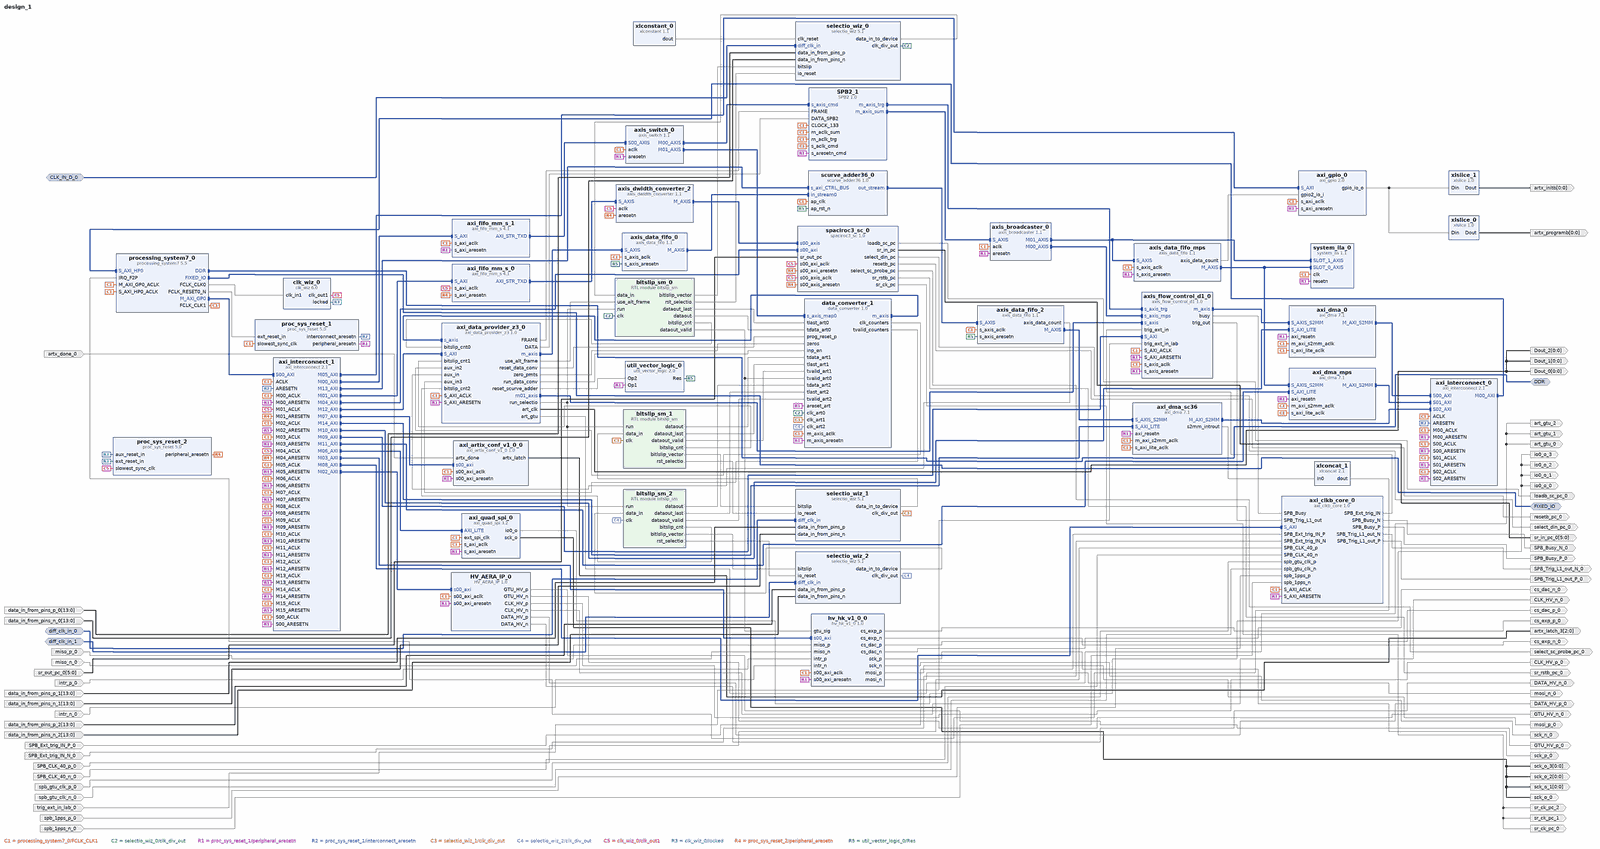
[diagram p0: block diagram of the top level, whole]
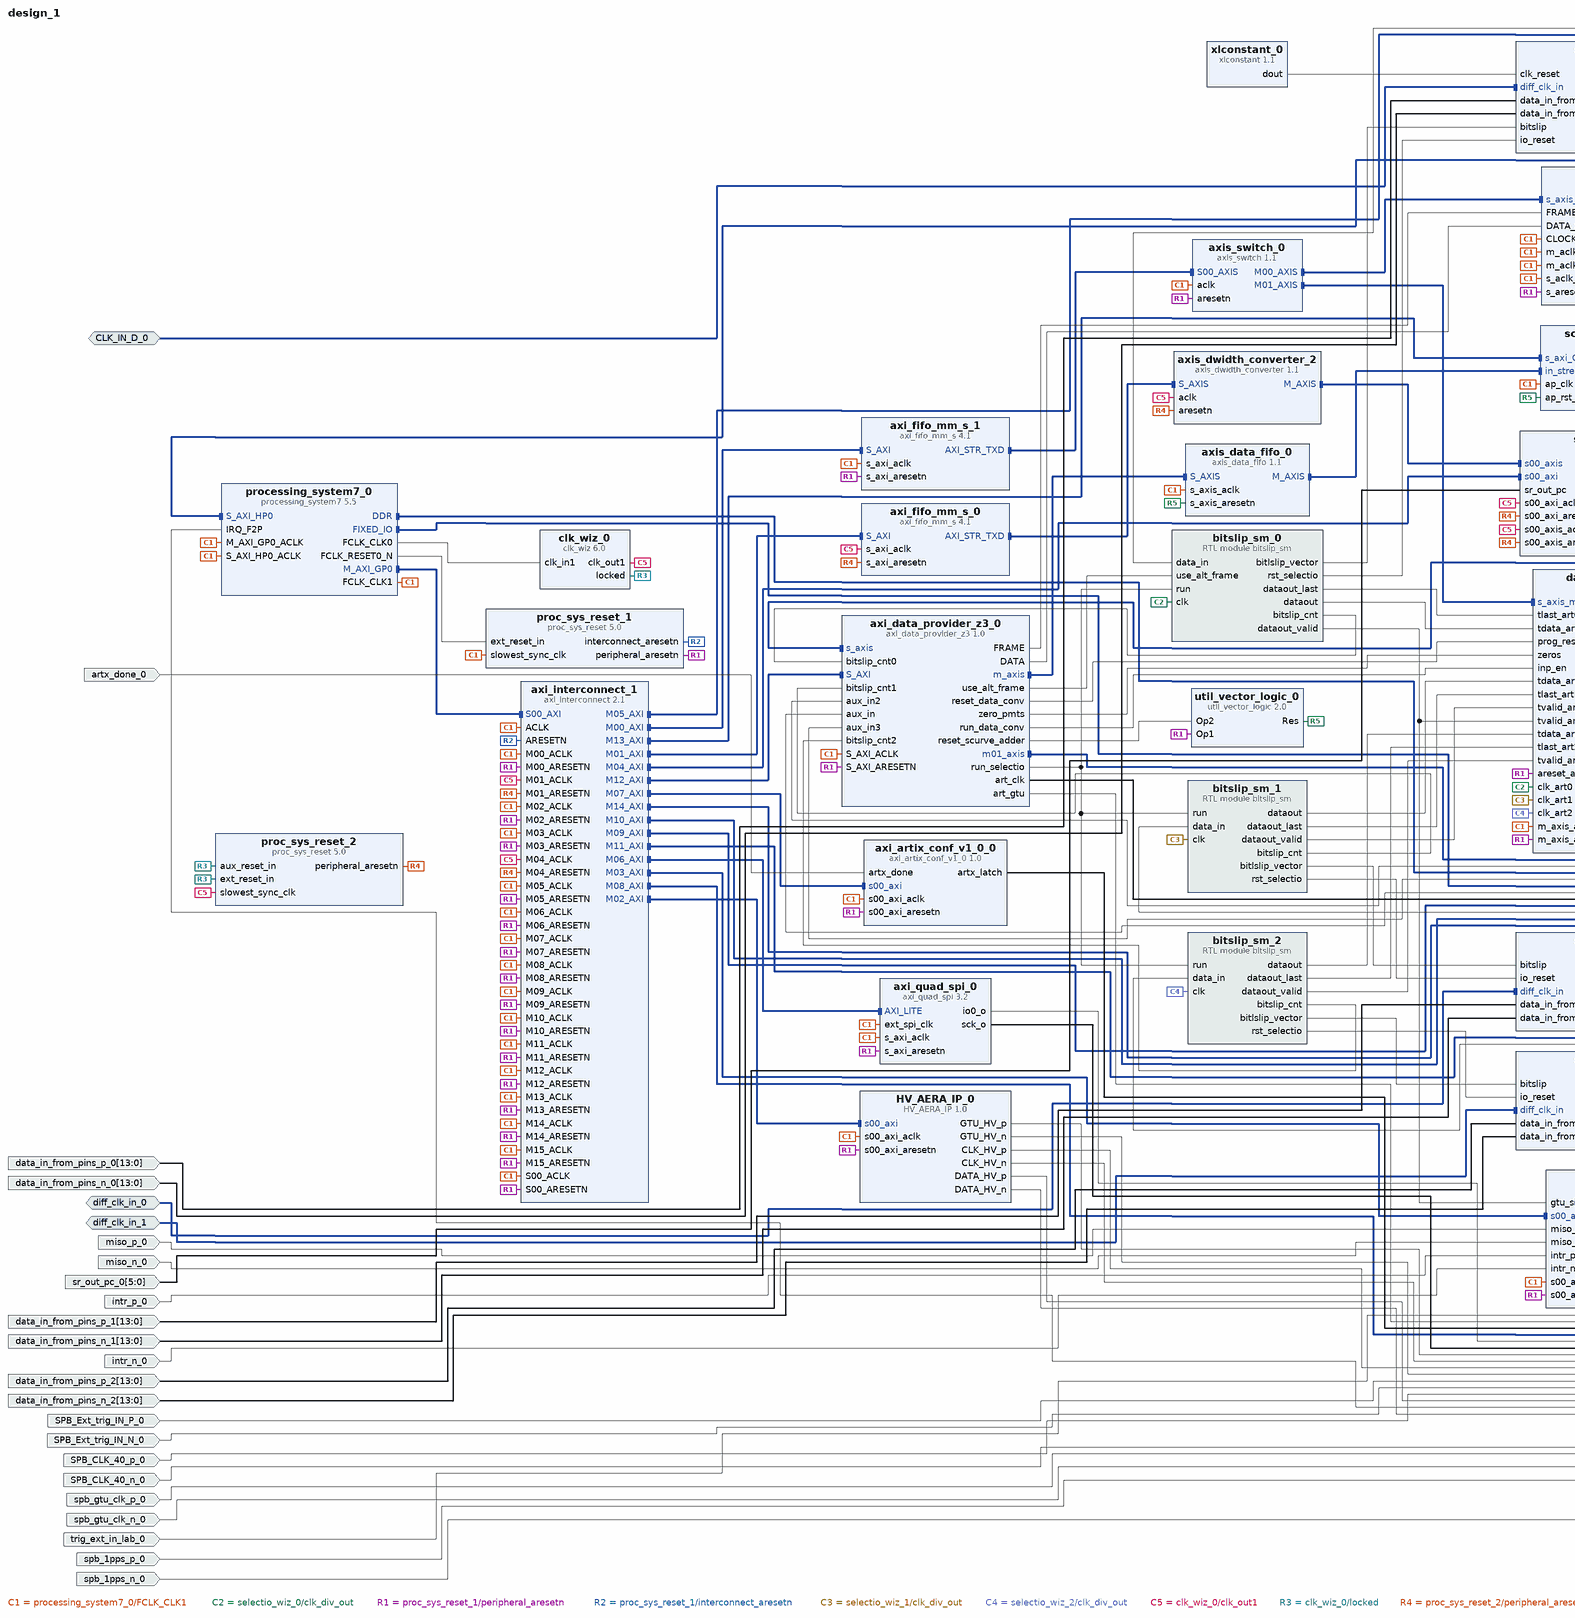
[diagram p1: block diagram of the top level, left part]
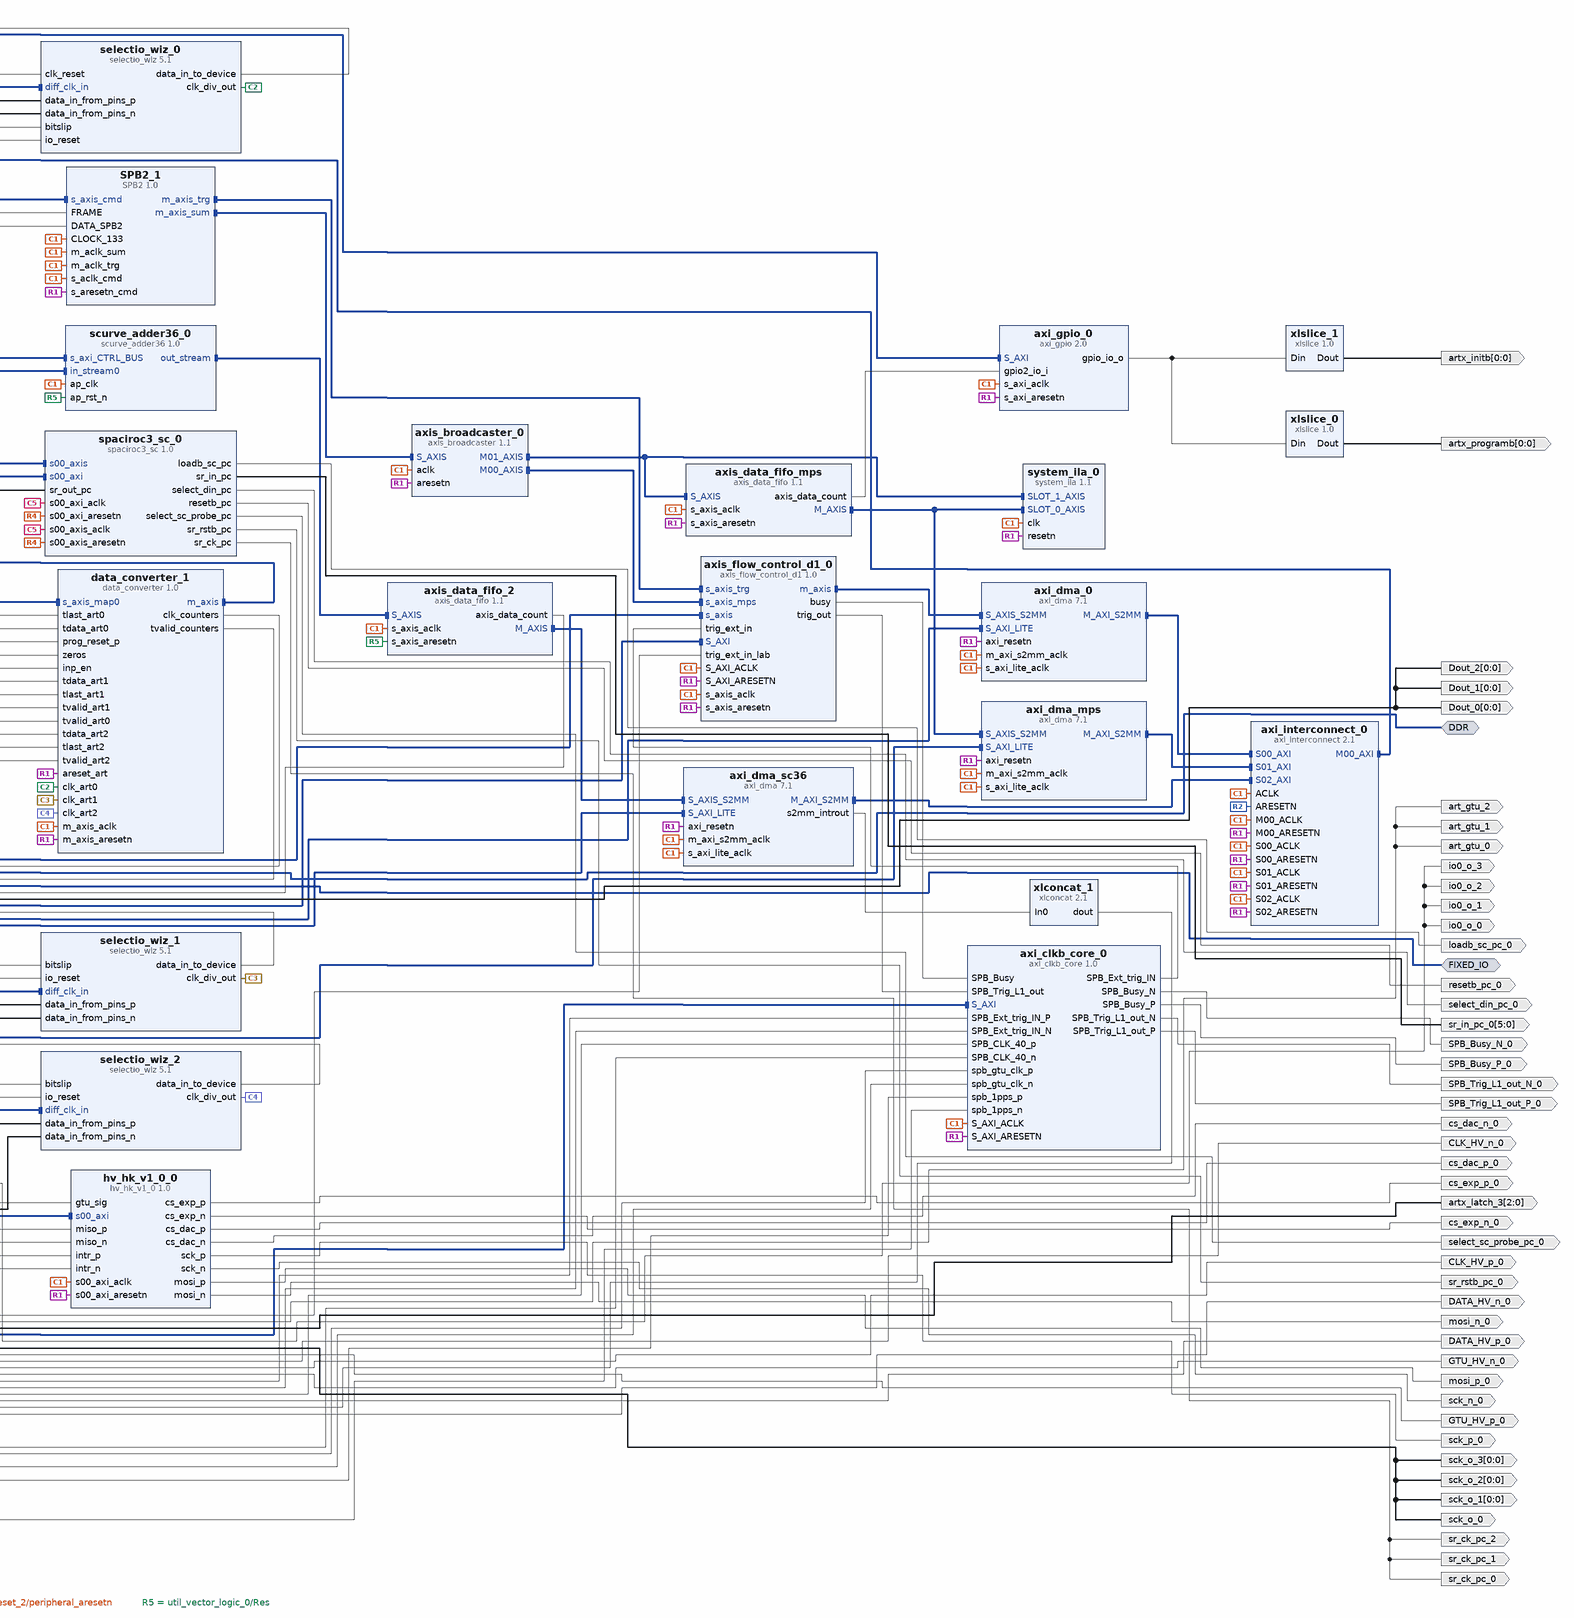
[diagram p2: block diagram of the top level, right part]
# Vivado block design design_1, xc7z035ffg676-2, Vivado 2018.1
create_bd_design design_1

create_bd_intf_port -mode Master -vlnv xilinx.com:interface:ddrx_rtl:1.0 DDR
create_bd_intf_port -mode Master -vlnv xilinx.com:display_processing_system7:fixedio_rtl:1.0 FIXED_IO
create_bd_intf_port -mode Slave -vlnv xilinx.com:interface:diff_clock_rtl:1.0 CLK_IN_D_0
create_bd_intf_port -mode Slave -vlnv xilinx.com:interface:diff_clock_rtl:1.0 diff_clk_in_0
create_bd_intf_port -mode Slave -vlnv xilinx.com:interface:diff_clock_rtl:1.0 diff_clk_in_1
create_bd_port -dir O -from 0 -to 0 Dout_2
create_bd_port -dir O -from 0 -to 0 Dout_1
create_bd_port -dir O -from 0 -to 0 Dout_0
create_bd_port -dir I -from 13 -to 0 data_in_from_pins_p_0
create_bd_port -dir I -from 13 -to 0 data_in_from_pins_n_0
create_bd_port -dir O sck_p_0
create_bd_port -dir O sck_n_0
create_bd_port -dir O mosi_p_0
create_bd_port -dir O mosi_n_0
create_bd_port -dir O cs_exp_p_0
create_bd_port -dir O cs_exp_n_0
create_bd_port -dir O cs_dac_p_0
create_bd_port -dir O cs_dac_n_0
create_bd_port -dir I miso_p_0
create_bd_port -dir I miso_n_0
create_bd_port -dir I intr_p_0
create_bd_port -dir I intr_n_0
create_bd_port -dir O -from 5 -to 0 sr_in_pc_0
create_bd_port -dir O loadb_sc_pc_0
create_bd_port -dir O select_din_pc_0
create_bd_port -dir O resetb_pc_0
create_bd_port -dir O select_sc_probe_pc_0
create_bd_port -dir O sr_rstb_pc_0
create_bd_port -dir O sr_ck_pc_1
create_bd_port -dir O sr_ck_pc_2
create_bd_port -dir O sr_ck_pc_0
create_bd_port -dir O GTU_HV_p_0
create_bd_port -dir O GTU_HV_n_0
create_bd_port -dir O CLK_HV_p_0
create_bd_port -dir O CLK_HV_n_0
create_bd_port -dir O DATA_HV_p_0
create_bd_port -dir O DATA_HV_n_0
create_bd_port -dir O io0_o_0
create_bd_port -dir O io0_o_1
create_bd_port -dir O io0_o_2
create_bd_port -dir O io0_o_3
create_bd_port -dir O sck_o_0
create_bd_port -dir O -from 0 -to 0 sck_o_1
create_bd_port -dir O -from 0 -to 0 sck_o_2
create_bd_port -dir O -from 0 -to 0 sck_o_3
create_bd_port -dir I artx_done_0
create_bd_port -dir I -from 13 -to 0 data_in_from_pins_p_1
create_bd_port -dir I -from 13 -to 0 data_in_from_pins_n_1
create_bd_port -dir I -from 13 -to 0 data_in_from_pins_p_2
create_bd_port -dir I -from 13 -to 0 data_in_from_pins_n_2
create_bd_port -dir O -from 0 -to 0 artx_programb
create_bd_port -dir O -from 0 -to 0 artx_initb
create_bd_port -dir I -from 5 -to 0 sr_out_pc_0
create_bd_port -dir O art_gtu_0
create_bd_port -dir O art_gtu_1
create_bd_port -dir O art_gtu_2
create_bd_port -dir O -from 2 -to 0 artx_latch_3
create_bd_port -dir I SPB_Ext_trig_IN_P_0
create_bd_port -dir I SPB_Ext_trig_IN_N_0
create_bd_port -dir I SPB_CLK_40_p_0
create_bd_port -dir I SPB_CLK_40_n_0
create_bd_port -dir O SPB_Trig_L1_out_P_0
create_bd_port -dir O SPB_Trig_L1_out_N_0
create_bd_port -dir O SPB_Busy_P_0
create_bd_port -dir O SPB_Busy_N_0
create_bd_port -dir I -type clk spb_gtu_clk_p_0
create_bd_port -dir I -type clk spb_gtu_clk_n_0
create_bd_port -dir I spb_1pps_p_0
create_bd_port -dir I spb_1pps_n_0
create_bd_port -dir I trig_ext_in_lab_0

create_bd_cell -type ip -vlnv xilinx.com:ip:processing_system7:5.5 processing_system7_0
set_property -dict [list \
  CONFIG.PCW_FCLK_CLK1_BUF TRUE \
  CONFIG.PCW_FCLK_CLK2_BUF TRUE \
  CONFIG.PCW_UIPARAM_DDR_FREQ_MHZ 533.333333 \
  CONFIG.PCW_CPU_CPU_6X4X_MAX_RANGE 800 \
  CONFIG.PCW_APU_PERIPHERAL_FREQMHZ 800 \
  CONFIG.PCW_SDIO_PERIPHERAL_FREQMHZ 100 \
  CONFIG.PCW_UART_PERIPHERAL_FREQMHZ 100 \
  CONFIG.PCW_FPGA0_PERIPHERAL_FREQMHZ 200 \
  CONFIG.PCW_FPGA1_PERIPHERAL_FREQMHZ 200 \
  CONFIG.PCW_FPGA2_PERIPHERAL_FREQMHZ 200 \
  CONFIG.PCW_FPGA3_PERIPHERAL_FREQMHZ 100 \
  CONFIG.PCW_USE_S_AXI_HP0 1 \
  CONFIG.PCW_USE_FABRIC_INTERRUPT 1 \
  CONFIG.PCW_EN_CLK1_PORT 1 \
  CONFIG.PCW_EN_CLK2_PORT 1 \
  CONFIG.PCW_IRQ_F2P_INTR 1 \
  CONFIG.PCW_GP0_EN_MODIFIABLE_TXN 0 \
  CONFIG.PCW_GP1_EN_MODIFIABLE_TXN 0 \
  CONFIG.PCW_PERIPHERAL_BOARD_PRESET None \
  CONFIG.PCW_PRESET_BANK0_VOLTAGE {LVCMOS 1.8V} \
  CONFIG.PCW_PRESET_BANK1_VOLTAGE {LVCMOS 1.8V} \
  CONFIG.PCW_UIPARAM_DDR_PARTNO {MT41K256M16 RE-15E} \
  CONFIG.PCW_QSPI_PERIPHERAL_ENABLE 0 \
  CONFIG.PCW_ENET0_PERIPHERAL_ENABLE 1 \
  CONFIG.PCW_ENET0_ENET0_IO {MIO 16 .. 27} \
  CONFIG.PCW_ENET0_GRP_MDIO_ENABLE 1 \
  CONFIG.PCW_ENET0_GRP_MDIO_IO {MIO 52 .. 53} \
  CONFIG.PCW_SD0_PERIPHERAL_ENABLE 1 \
  CONFIG.PCW_SD0_SD0_IO {MIO 40 .. 45} \
  CONFIG.PCW_SD0_GRP_CD_ENABLE 0 \
  CONFIG.PCW_SD0_GRP_WP_ENABLE 0 \
  CONFIG.PCW_UART0_PERIPHERAL_ENABLE 1 \
  CONFIG.PCW_UART0_UART0_IO {MIO 50 .. 51} \
  CONFIG.PCW_UART1_PERIPHERAL_ENABLE 0 \
  CONFIG.PCW_USB0_PERIPHERAL_ENABLE 0 \
  CONFIG.PCW_GPIO_MIO_GPIO_ENABLE 0 \
  CONFIG.PCW_FPGA_FCLK1_ENABLE 1 \
  CONFIG.PCW_FPGA_FCLK2_ENABLE 1 \
] [get_bd_cells processing_system7_0]
# 407 more settings of processing_system7_0 are not shown: defaults, MIO pin electricals, DDR timing, and values the tool derives
create_bd_cell -type ip -vlnv xilinx.com:ip:proc_sys_reset:5.0 proc_sys_reset_1
create_bd_cell -type ip -vlnv xilinx.com:ip:axi_interconnect:2.1 axi_interconnect_0
set_property -dict [list \
  CONFIG.NUM_SI 3 \
  CONFIG.NUM_MI 1 \
  CONFIG.M00_HAS_REGSLICE 4 \
  CONFIG.S00_HAS_REGSLICE 4 \
  CONFIG.S01_HAS_REGSLICE 4 \
  CONFIG.S02_HAS_REGSLICE 4 \
] [get_bd_cells axi_interconnect_0]
create_bd_cell -type ip -vlnv xilinx.com:ip:axi_interconnect:2.1 axi_interconnect_1
set_property -dict {CONFIG.NUM_MI 16} [get_bd_cells axi_interconnect_1]
create_bd_cell -type ip -vlnv xilinx.com:ip:selectio_wiz:5.1 selectio_wiz_0
set_property -dict [list \
  CONFIG.BUS_SIG_TYPE DIFF \
  CONFIG.BUS_IO_STD LVDS \
  CONFIG.SELIO_ACTIVE_EDGE DDR \
  CONFIG.USE_SERIALIZATION true \
  CONFIG.SERIALIZATION_FACTOR 8 \
  CONFIG.SYSTEM_DATA_WIDTH 14 \
  CONFIG.SELIO_INTERFACE_TYPE NETWORKING \
  CONFIG.SELIO_BUS_IN_DELAY NONE \
  CONFIG.SELIO_BUS_IN_TAP 3 \
  CONFIG.SELIO_CLK_SIG_TYPE DIFF \
  CONFIG.SELIO_CLK_IO_STD LVDS \
  CONFIG.CLK_DELAY NONE \
  CONFIG.CLK_TAP 8 \
  CONFIG.CLK_FWD_SIG_TYPE DIFF \
  CONFIG.CLK_FWD_IO_STD LVDS \
  CONFIG.INCLUDE_IDELAYCTRL false \
  CONFIG.INCLUDE_IDELAYCTRL_BUFG false \
] [get_bd_cells selectio_wiz_0]
create_bd_cell -type ip -vlnv user.org:user:HV_AERA_IP:1.0 HV_AERA_IP_0
create_bd_cell -type ip -vlnv user.org:user:hv_hk_v1_0:1.0 hv_hk_v1_0_0
create_bd_cell -type ip -vlnv xilinx.com:ip:axis_dwidth_converter:1.1 axis_dwidth_converter_2
set_property -dict {CONFIG.S_TDATA_NUM_BYTES 4 CONFIG.M_TDATA_NUM_BYTES 24} [get_bd_cells axis_dwidth_converter_2]
create_bd_cell -type ip -vlnv xilinx.com:ip:axi_fifo_mm_s:4.1 axi_fifo_mm_s_0
set_property -dict [list \
  CONFIG.C_USE_TX_CUT_THROUGH 0 \
  CONFIG.C_TX_FIFO_PE_THRESHOLD 2 \
  CONFIG.C_TX_FIFO_PF_THRESHOLD 4091 \
  CONFIG.C_TX_FIFO_DEPTH 4096 \
  CONFIG.C_USE_TX_DATA 1 \
  CONFIG.C_USE_RX_DATA 1 \
  CONFIG.C_USE_TX_CTRL 0 \
] [get_bd_cells axi_fifo_mm_s_0]
create_bd_cell -type ip -vlnv xilinx.com:ip:xlconcat:2.1 xlconcat_1
set_property -dict {CONFIG.NUM_PORTS 1} [get_bd_cells xlconcat_1]
create_bd_cell -type ip -vlnv xilinx.com:ip:axi_gpio:2.0 axi_gpio_0
set_property -dict {CONFIG.C_IS_DUAL 1 CONFIG.C_ALL_INPUTS_2 1 CONFIG.C_ALL_OUTPUTS 1} [get_bd_cells axi_gpio_0]
create_bd_cell -type ip -vlnv xilinx.com:ip:axi_quad_spi:3.2 axi_quad_spi_0
set_property -dict [list \
  CONFIG.C_USE_STARTUP 0 \
  CONFIG.C_SCK_RATIO 16 \
  CONFIG.C_FIFO_DEPTH 16 \
  CONFIG.Multiples16 2 \
] [get_bd_cells axi_quad_spi_0]
create_bd_cell -type ip -vlnv xilinx.com:ip:xlconstant:1.1 xlconstant_0
set_property -dict {CONFIG.CONST_VAL 0} [get_bd_cells xlconstant_0]
create_bd_cell -type ip -vlnv xilinx.com:ip:selectio_wiz:5.1 selectio_wiz_2
set_property -dict [list \
  CONFIG.BUS_SIG_TYPE DIFF \
  CONFIG.BUS_IO_STD LVDS \
  CONFIG.SELIO_ACTIVE_EDGE DDR \
  CONFIG.USE_SERIALIZATION true \
  CONFIG.SERIALIZATION_FACTOR 8 \
  CONFIG.SYSTEM_DATA_WIDTH 14 \
  CONFIG.SELIO_INTERFACE_TYPE NETWORKING \
  CONFIG.SELIO_BUS_IN_DELAY NONE \
  CONFIG.SELIO_BUS_IN_TAP 0 \
  CONFIG.SELIO_CLK_SIG_TYPE DIFF \
  CONFIG.SELIO_CLK_IO_STD LVDS \
  CONFIG.CLK_DELAY NONE \
  CONFIG.CLK_TAP 0 \
  CONFIG.CLK_FWD_SIG_TYPE DIFF \
  CONFIG.CLK_FWD_IO_STD LVDS \
] [get_bd_cells selectio_wiz_2]
create_bd_cell -type ip -vlnv xilinx.com:ip:selectio_wiz:5.1 selectio_wiz_1
set_property -dict [list \
  CONFIG.BUS_SIG_TYPE DIFF \
  CONFIG.BUS_IO_STD LVDS \
  CONFIG.SELIO_ACTIVE_EDGE DDR \
  CONFIG.USE_SERIALIZATION true \
  CONFIG.SERIALIZATION_FACTOR 8 \
  CONFIG.SYSTEM_DATA_WIDTH 14 \
  CONFIG.SELIO_INTERFACE_TYPE NETWORKING \
  CONFIG.SELIO_BUS_IN_DELAY NONE \
  CONFIG.SELIO_BUS_IN_TAP 0 \
  CONFIG.SELIO_CLK_SIG_TYPE DIFF \
  CONFIG.SELIO_CLK_IO_STD LVDS \
  CONFIG.CLK_DELAY NONE \
  CONFIG.CLK_TAP 0 \
  CONFIG.CLK_FWD_SIG_TYPE DIFF \
  CONFIG.CLK_FWD_IO_STD LVDS \
] [get_bd_cells selectio_wiz_1]
create_bd_cell -type ip -vlnv xilinx.com:ip:axis_data_fifo:1.1 axis_data_fifo_2
set_property -dict [list \
  CONFIG.TID_WIDTH 0 \
  CONFIG.TDEST_WIDTH 0 \
  CONFIG.TUSER_WIDTH 0 \
  CONFIG.HAS_TSTRB 0 \
  CONFIG.HAS_TKEEP 0 \
] [get_bd_cells axis_data_fifo_2]
create_bd_cell -type ip -vlnv xilinx.com:ip:axi_dma:7.1 axi_dma_sc36
set_property -dict [list \
  CONFIG.c_include_sg 0 \
  CONFIG.c_sg_length_width 25 \
  CONFIG.c_include_mm2s 0 \
  CONFIG.c_include_s2mm 1 \
] [get_bd_cells axi_dma_sc36]
create_bd_cell -type ip -vlnv xilinx.com:ip:axis_data_fifo:1.1 axis_data_fifo_0
create_bd_cell -type ip -vlnv xilinx.com:ip:axi_dma:7.1 axi_dma_0
set_property -dict [list \
  CONFIG.c_include_sg 0 \
  CONFIG.c_sg_length_width 23 \
  CONFIG.c_include_mm2s 0 \
  CONFIG.c_include_s2mm 1 \
] [get_bd_cells axi_dma_0]
create_bd_cell -type ip -vlnv xilinx.com:ip:clk_wiz:6.0 clk_wiz_0
set_property -dict {CONFIG.USE_RESET false} [get_bd_cells clk_wiz_0]
create_bd_cell -type ip -vlnv xilinx.com:ip:proc_sys_reset:5.0 proc_sys_reset_2
create_bd_cell -type ip -vlnv xilinx.com:ip:xlslice:1.0 xlslice_0
create_bd_cell -type ip -vlnv xilinx.com:ip:xlslice:1.0 xlslice_1
set_property -dict {CONFIG.DIN_TO 1 CONFIG.DIN_FROM 1 CONFIG.DOUT_WIDTH 1} [get_bd_cells xlslice_1]
create_bd_cell -type ip -vlnv xilinx.com:ip:util_vector_logic:2.0 util_vector_logic_0
set_property -dict {CONFIG.C_SIZE 1} [get_bd_cells util_vector_logic_0]
create_bd_cell -type ip -vlnv xilinx.com:ip:axi_fifo_mm_s:4.1 axi_fifo_mm_s_1
set_property -dict {CONFIG.C_HAS_AXIS_TDEST true CONFIG.C_USE_RX_DATA 0 CONFIG.C_USE_TX_CTRL 0} [get_bd_cells axi_fifo_mm_s_1]
create_bd_cell -type ip -vlnv xilinx.com:ip:axis_switch:1.1 axis_switch_0
set_property -dict {CONFIG.NUM_SI 1 CONFIG.NUM_MI 2 CONFIG.DECODER_REG 1} [get_bd_cells axis_switch_0]
create_bd_cell -type ip -vlnv xilinx.com:hls:scurve_adder36:1.0 scurve_adder36_0
create_bd_cell -type ip -vlnv xilinx.com:ip:axis_data_fifo:1.1 axis_data_fifo_mps
set_property -dict {CONFIG.FIFO_DEPTH 16384} [get_bd_cells axis_data_fifo_mps]
create_bd_cell -type ip -vlnv xilinx.com:ip:axi_dma:7.1 axi_dma_mps
set_property -dict {CONFIG.c_include_sg 0 CONFIG.c_include_mm2s 0 CONFIG.c_include_s2mm 1} [get_bd_cells axi_dma_mps]
create_bd_cell -type ip -vlnv xilinx.com:ip:axis_broadcaster:1.1 axis_broadcaster_0
create_bd_cell -type ip -vlnv user.org:user:spaciroc3_sc:1.0 spaciroc3_sc_0
create_bd_cell -type module -reference bitslip_sm bitslip_sm_0
create_bd_cell -type module -reference bitslip_sm bitslip_sm_1
create_bd_cell -type module -reference bitslip_sm bitslip_sm_2
create_bd_cell -type ip -vlnv xilinx.com:user:axi_artix_conf_v1_0:1.0 axi_artix_conf_v1_0_0
create_bd_cell -type ip -vlnv user.org:user:data_converter:1.0 data_converter_1
create_bd_cell -type ip -vlnv user.org:user:SPB2:1.0 SPB2_1
create_bd_cell -type ip -vlnv user.org:user:axi_clkb_core:1.0 axi_clkb_core_0
create_bd_cell -type ip -vlnv xilinx.com:ip:system_ila:1.1 system_ila_0
set_property -dict [list \
  CONFIG.C_SLOT_0_APC_EN 0 \
  CONFIG.C_SLOT_1_APC_EN 0 \
  CONFIG.C_SLOT_0_AXI_DATA_SEL 1 \
  CONFIG.C_SLOT_1_AXI_DATA_SEL 1 \
  CONFIG.C_SLOT_0_AXI_TRIG_SEL 1 \
  CONFIG.C_SLOT_1_AXI_TRIG_SEL 1 \
  CONFIG.C_DATA_DEPTH 4096 \
  CONFIG.C_EN_STRG_QUAL 1 \
  CONFIG.C_ADV_TRIGGER true \
  CONFIG.C_PROBE0_MU_CNT 2 \
  CONFIG.ALL_PROBE_SAME_MU_CNT 2 \
  CONFIG.C_NUM_MONITOR_SLOTS 2 \
  CONFIG.C_SLOT_0_INTF_TYPE xilinx.com:interface:axis_rtl:1.0 \
  CONFIG.C_SLOT_1_INTF_TYPE xilinx.com:interface:axis_rtl:1.0 \
  CONFIG.C_MON_TYPE INTERFACE \
] [get_bd_cells system_ila_0]
create_bd_cell -type ip -vlnv user.org:user:axi_data_provider_z3:1.0 axi_data_provider_z3_0
create_bd_cell -type ip -vlnv user.org:user:axis_flow_control_d1:1.0 axis_flow_control_d1_0

# ---- connections ----

connect_bd_intf_net [get_bd_intf_pins axi_interconnect_0/M00_AXI] [get_bd_intf_pins processing_system7_0/S_AXI_HP0]
connect_bd_intf_net [get_bd_intf_pins axi_interconnect_1/S00_AXI] [get_bd_intf_pins processing_system7_0/M_AXI_GP0]
connect_bd_intf_net [get_bd_intf_pins axi_fifo_mm_s_0/AXI_STR_TXD] [get_bd_intf_pins axis_dwidth_converter_2/S_AXIS]
connect_bd_intf_net [get_bd_intf_pins axis_dwidth_converter_2/M_AXIS] [get_bd_intf_pins spaciroc3_sc_0/s00_axis]
connect_bd_intf_net [get_bd_intf_pins axi_interconnect_1/M01_AXI] [get_bd_intf_pins axi_fifo_mm_s_0/S_AXI]
connect_bd_intf_net [get_bd_intf_pins axi_interconnect_1/M02_AXI] [get_bd_intf_pins HV_AERA_IP_0/s00_axi]
connect_bd_intf_net [get_bd_intf_pins axi_interconnect_1/M03_AXI] [get_bd_intf_pins hv_hk_v1_0_0/s00_axi]
connect_bd_intf_net [get_bd_intf_pins spaciroc3_sc_0/s00_axi] [get_bd_intf_pins axi_interconnect_1/M04_AXI]
connect_bd_intf_net [get_bd_intf_pins axi_interconnect_1/M05_AXI] [get_bd_intf_pins axi_gpio_0/S_AXI]
connect_bd_intf_net [get_bd_intf_pins axi_interconnect_1/M06_AXI] [get_bd_intf_pins axi_quad_spi_0/AXI_LITE]
connect_bd_intf_net [get_bd_intf_pins axi_interconnect_1/M07_AXI] [get_bd_intf_pins axi_artix_conf_v1_0_0/s00_axi]
connect_bd_intf_net [get_bd_intf_pins axi_data_provider_z3_0/S_AXI] [get_bd_intf_pins axi_interconnect_1/M12_AXI]
connect_bd_intf_net [get_bd_intf_pins axi_interconnect_1/M13_AXI] [get_bd_intf_pins scurve_adder36_0/s_axi_CTRL_BUS]
connect_bd_intf_net [get_bd_intf_pins scurve_adder36_0/out_stream] [get_bd_intf_pins axis_data_fifo_2/S_AXIS]
connect_bd_intf_net [get_bd_intf_pins axi_interconnect_0/S02_AXI] [get_bd_intf_pins axi_dma_sc36/M_AXI_S2MM]
connect_bd_intf_net [get_bd_intf_pins axi_dma_sc36/S_AXI_LITE] [get_bd_intf_pins axi_interconnect_1/M14_AXI]
connect_bd_intf_net [get_bd_intf_pins axi_dma_sc36/S_AXIS_S2MM] [get_bd_intf_pins axis_data_fifo_2/M_AXIS]
connect_bd_intf_net [get_bd_intf_pins scurve_adder36_0/in_stream0] [get_bd_intf_pins axis_data_fifo_0/M_AXIS]
connect_bd_intf_net [get_bd_intf_pins axi_dma_0/M_AXI_S2MM] [get_bd_intf_pins axi_interconnect_0/S00_AXI]
connect_bd_intf_net [get_bd_intf_pins axi_dma_0/S_AXI_LITE] [get_bd_intf_pins axi_interconnect_1/M10_AXI]
connect_bd_intf_net [get_bd_intf_pins data_converter_1/m_axis] [get_bd_intf_pins axi_data_provider_z3_0/s_axis]
connect_bd_intf_net [get_bd_intf_pins axis_data_fifo_0/S_AXIS] [get_bd_intf_pins axi_data_provider_z3_0/m_axis]
connect_bd_intf_net [get_bd_intf_pins axis_flow_control_d1_0/m_axis] [get_bd_intf_pins axi_dma_0/S_AXIS_S2MM]
connect_bd_intf_net [get_bd_intf_pins axis_flow_control_d1_0/s_axis] [get_bd_intf_pins axi_data_provider_z3_0/m01_axis]
connect_bd_intf_net [get_bd_intf_pins axis_flow_control_d1_0/S_AXI] [get_bd_intf_pins axi_interconnect_1/M09_AXI]
connect_bd_intf_net [get_bd_intf_pins axi_fifo_mm_s_1/S_AXI] [get_bd_intf_pins axi_interconnect_1/M00_AXI]
connect_bd_intf_net [get_bd_intf_pins axi_fifo_mm_s_1/AXI_STR_TXD] [get_bd_intf_pins axis_switch_0/S00_AXIS]
connect_bd_intf_net [get_bd_intf_pins axis_switch_0/M01_AXIS] [get_bd_intf_pins data_converter_1/s_axis_map0]
connect_bd_intf_net [get_bd_intf_pins axis_data_fifo_mps/M_AXIS] [get_bd_intf_pins axi_dma_mps/S_AXIS_S2MM]
connect_bd_intf_net [get_bd_intf_pins axis_data_fifo_mps/M_AXIS] [get_bd_intf_pins system_ila_0/SLOT_0_AXIS]
connect_bd_intf_net [get_bd_intf_pins axi_interconnect_0/S01_AXI] [get_bd_intf_pins axi_dma_mps/M_AXI_S2MM]
connect_bd_intf_net [get_bd_intf_pins axi_dma_mps/S_AXI_LITE] [get_bd_intf_pins axi_interconnect_1/M11_AXI]
connect_bd_intf_net [get_bd_intf_pins SPB2_1/s_axis_cmd] [get_bd_intf_pins axis_switch_0/M00_AXIS]
connect_bd_intf_net [get_bd_intf_pins SPB2_1/m_axis_trg] [get_bd_intf_pins axis_flow_control_d1_0/s_axis_trg]
connect_bd_intf_net [get_bd_intf_pins axis_broadcaster_0/S_AXIS] [get_bd_intf_pins SPB2_1/m_axis_sum]
connect_bd_intf_net [get_bd_intf_pins axis_broadcaster_0/M00_AXIS] [get_bd_intf_pins axis_flow_control_d1_0/s_axis_mps]
connect_bd_intf_net [get_bd_intf_pins axis_broadcaster_0/M01_AXIS] [get_bd_intf_pins axis_data_fifo_mps/S_AXIS]
connect_bd_intf_net [get_bd_intf_pins axis_broadcaster_0/M01_AXIS] [get_bd_intf_pins system_ila_0/SLOT_1_AXIS]
connect_bd_intf_net [get_bd_intf_pins axi_clkb_core_0/S_AXI] [get_bd_intf_pins axi_interconnect_1/M08_AXI]
connect_bd_intf_net [get_bd_intf_ports DDR] [get_bd_intf_pins processing_system7_0/DDR]
connect_bd_intf_net [get_bd_intf_ports FIXED_IO] [get_bd_intf_pins processing_system7_0/FIXED_IO]
connect_bd_intf_net -intf_net CLK_IN_D_0_1 [get_bd_intf_ports CLK_IN_D_0] [get_bd_intf_pins selectio_wiz_0/diff_clk_in]
connect_bd_intf_net -intf_net diff_clk_in_0_1 [get_bd_intf_ports diff_clk_in_0] [get_bd_intf_pins selectio_wiz_1/diff_clk_in]
connect_bd_intf_net -intf_net diff_clk_in_1_1 [get_bd_intf_ports diff_clk_in_1] [get_bd_intf_pins selectio_wiz_2/diff_clk_in]
connect_bd_net -net xlslice_Zynq_Dout [get_bd_pins axi_data_provider_z3_0/art_clk] [get_bd_ports Dout_0] [get_bd_ports Dout_1] [get_bd_ports Dout_2]
connect_bd_net -net data_in_from_pins_p_0_1 [get_bd_ports data_in_from_pins_p_0] [get_bd_pins selectio_wiz_0/data_in_from_pins_p]
connect_bd_net -net data_in_from_pins_n_0_1 [get_bd_ports data_in_from_pins_n_0] [get_bd_pins selectio_wiz_0/data_in_from_pins_n]
connect_bd_net [get_bd_pins processing_system7_0/FCLK_CLK1] \
  [get_bd_pins proc_sys_reset_1/slowest_sync_clk] [get_bd_pins processing_system7_0/M_AXI_GP0_ACLK] \
  [get_bd_pins processing_system7_0/S_AXI_HP0_ACLK] [get_bd_pins HV_AERA_IP_0/s00_axi_aclk] \
  [get_bd_pins hv_hk_v1_0_0/s00_axi_aclk] [get_bd_pins axi_gpio_0/s_axi_aclk] [get_bd_pins axi_quad_spi_0/s_axi_aclk] \
  [get_bd_pins axi_quad_spi_0/ext_spi_clk] [get_bd_pins axis_data_fifo_2/s_axis_aclk] \
  [get_bd_pins axi_dma_sc36/m_axi_s2mm_aclk] [get_bd_pins axi_dma_sc36/s_axi_lite_aclk] \
  [get_bd_pins axi_dma_0/m_axi_s2mm_aclk] [get_bd_pins axi_dma_0/s_axi_lite_aclk] [get_bd_pins axi_fifo_mm_s_1/s_axi_aclk] \
  [get_bd_pins axis_switch_0/aclk] [get_bd_pins scurve_adder36_0/ap_clk] [get_bd_pins axis_data_fifo_0/s_axis_aclk] \
  [get_bd_pins axis_data_fifo_mps/s_axis_aclk] [get_bd_pins axi_dma_mps/s_axi_lite_aclk] \
  [get_bd_pins axi_dma_mps/m_axi_s2mm_aclk] [get_bd_pins axis_broadcaster_0/aclk] \
  [get_bd_pins axi_artix_conf_v1_0_0/s00_axi_aclk] [get_bd_pins data_converter_1/m_axis_aclk] [get_bd_pins SPB2_1/CLOCK_133] \
  [get_bd_pins SPB2_1/m_aclk_sum] [get_bd_pins SPB2_1/s_aclk_cmd] [get_bd_pins SPB2_1/m_aclk_trg] \
  [get_bd_pins axi_clkb_core_0/S_AXI_ACLK] [get_bd_pins system_ila_0/clk] [get_bd_pins axi_data_provider_z3_0/S_AXI_ACLK] \
  [get_bd_pins axi_interconnect_0/ACLK] [get_bd_pins axi_interconnect_0/S00_ACLK] [get_bd_pins axi_interconnect_0/M00_ACLK] \
  [get_bd_pins axi_interconnect_1/ACLK] [get_bd_pins axi_interconnect_1/S00_ACLK] [get_bd_pins axi_interconnect_1/M00_ACLK] \
  [get_bd_pins axi_interconnect_1/M02_ACLK] [get_bd_pins axi_interconnect_1/M03_ACLK] \
  [get_bd_pins axi_interconnect_1/M05_ACLK] [get_bd_pins axi_interconnect_1/M06_ACLK] \
  [get_bd_pins axi_interconnect_1/M07_ACLK] [get_bd_pins axi_interconnect_1/M08_ACLK] \
  [get_bd_pins axi_interconnect_0/S01_ACLK] [get_bd_pins axi_interconnect_1/M09_ACLK] \
  [get_bd_pins axi_interconnect_1/M10_ACLK] [get_bd_pins axi_interconnect_1/M11_ACLK] \
  [get_bd_pins axi_interconnect_1/M12_ACLK] [get_bd_pins axi_interconnect_1/M13_ACLK] \
  [get_bd_pins axi_interconnect_0/S02_ACLK] [get_bd_pins axi_interconnect_1/M14_ACLK] \
  [get_bd_pins axi_interconnect_1/M15_ACLK] [get_bd_pins axis_flow_control_d1_0/s_axis_aclk] \
  [get_bd_pins axis_flow_control_d1_0/S_AXI_ACLK]
connect_bd_net -net util_ds_buf_0_BUFG_O [get_bd_pins selectio_wiz_0/clk_div_out] \
  [get_bd_pins bitslip_sm_0/clk] [get_bd_pins data_converter_1/clk_art0]
connect_bd_net [get_bd_pins bitslip_sm_0/dataout_valid] [get_bd_pins hv_hk_v1_0_0/gtu_sig] [get_bd_pins data_converter_1/tvalid_art0]
connect_bd_net [get_bd_pins processing_system7_0/FCLK_RESET0_N] [get_bd_pins proc_sys_reset_1/ext_reset_in]
connect_bd_net [get_bd_pins proc_sys_reset_1/peripheral_aresetn] \
  [get_bd_pins HV_AERA_IP_0/s00_axi_aresetn] [get_bd_pins hv_hk_v1_0_0/s00_axi_aresetn] \
  [get_bd_pins axi_gpio_0/s_axi_aresetn] [get_bd_pins axi_quad_spi_0/s_axi_aresetn] [get_bd_pins axi_dma_sc36/axi_resetn] \
  [get_bd_pins axi_dma_0/axi_resetn] [get_bd_pins util_vector_logic_0/Op1] [get_bd_pins axi_fifo_mm_s_1/s_axi_aresetn] \
  [get_bd_pins axis_switch_0/aresetn] [get_bd_pins axis_data_fifo_mps/s_axis_aresetn] [get_bd_pins axi_dma_mps/axi_resetn] \
  [get_bd_pins axis_broadcaster_0/aresetn] [get_bd_pins axi_artix_conf_v1_0_0/s00_axi_aresetn] \
  [get_bd_pins data_converter_1/areset_art] [get_bd_pins data_converter_1/m_axis_aresetn] [get_bd_pins SPB2_1/s_aresetn_cmd] \
  [get_bd_pins axi_clkb_core_0/S_AXI_ARESETN] [get_bd_pins system_ila_0/resetn] \
  [get_bd_pins axi_data_provider_z3_0/S_AXI_ARESETN] [get_bd_pins axi_interconnect_0/S00_ARESETN] \
  [get_bd_pins axi_interconnect_0/M00_ARESETN] [get_bd_pins axi_interconnect_1/S00_ARESETN] \
  [get_bd_pins axi_interconnect_1/M00_ARESETN] [get_bd_pins axi_interconnect_1/M02_ARESETN] \
  [get_bd_pins axi_interconnect_1/M03_ARESETN] [get_bd_pins axi_interconnect_1/M05_ARESETN] \
  [get_bd_pins axi_interconnect_1/M06_ARESETN] [get_bd_pins axi_interconnect_1/M07_ARESETN] \
  [get_bd_pins axi_interconnect_1/M08_ARESETN] [get_bd_pins axi_interconnect_0/S01_ARESETN] \
  [get_bd_pins axi_interconnect_1/M09_ARESETN] [get_bd_pins axi_interconnect_1/M10_ARESETN] \
  [get_bd_pins axi_interconnect_1/M11_ARESETN] [get_bd_pins axi_interconnect_1/M12_ARESETN] \
  [get_bd_pins axi_interconnect_1/M13_ARESETN] [get_bd_pins axi_interconnect_0/S02_ARESETN] \
  [get_bd_pins axi_interconnect_1/M14_ARESETN] [get_bd_pins axi_interconnect_1/M15_ARESETN] \
  [get_bd_pins axis_flow_control_d1_0/s_axis_aresetn] [get_bd_pins axis_flow_control_d1_0/S_AXI_ARESETN]
connect_bd_net -net ARESETN_1 [get_bd_pins proc_sys_reset_1/interconnect_aresetn] \
  [get_bd_pins axi_interconnect_0/ARESETN] [get_bd_pins axi_interconnect_1/ARESETN]
connect_bd_net [get_bd_pins selectio_wiz_0/data_in_to_device] [get_bd_pins bitslip_sm_0/data_in]
connect_bd_net [get_bd_pins bitslip_sm_0/bitlslip_vector] [get_bd_pins selectio_wiz_0/bitslip]
connect_bd_net [get_bd_pins xlconcat_1/dout] [get_bd_pins processing_system7_0/IRQ_F2P]
connect_bd_net [get_bd_pins hv_hk_v1_0_0/sck_p] [get_bd_ports sck_p_0]
connect_bd_net [get_bd_pins hv_hk_v1_0_0/sck_n] [get_bd_ports sck_n_0]
connect_bd_net [get_bd_pins hv_hk_v1_0_0/mosi_p] [get_bd_ports mosi_p_0]
connect_bd_net [get_bd_pins hv_hk_v1_0_0/mosi_n] [get_bd_ports mosi_n_0]
connect_bd_net [get_bd_pins hv_hk_v1_0_0/cs_exp_p] [get_bd_ports cs_exp_p_0]
connect_bd_net [get_bd_pins hv_hk_v1_0_0/cs_exp_n] [get_bd_ports cs_exp_n_0]
connect_bd_net [get_bd_pins hv_hk_v1_0_0/cs_dac_p] [get_bd_ports cs_dac_p_0]
connect_bd_net [get_bd_pins hv_hk_v1_0_0/cs_dac_n] [get_bd_ports cs_dac_n_0]
connect_bd_net -net miso_p_0_1 [get_bd_ports miso_p_0] [get_bd_pins hv_hk_v1_0_0/miso_p]
connect_bd_net -net miso_n_0_1 [get_bd_ports miso_n_0] [get_bd_pins hv_hk_v1_0_0/miso_n]
connect_bd_net -net intr_p_0_1 [get_bd_ports intr_p_0] [get_bd_pins hv_hk_v1_0_0/intr_p]
connect_bd_net -net intr_n_0_1 [get_bd_ports intr_n_0] [get_bd_pins hv_hk_v1_0_0/intr_n]
connect_bd_net [get_bd_pins spaciroc3_sc_0/sr_in_pc] [get_bd_ports sr_in_pc_0]
connect_bd_net [get_bd_pins spaciroc3_sc_0/loadb_sc_pc] [get_bd_ports loadb_sc_pc_0]
connect_bd_net [get_bd_pins spaciroc3_sc_0/select_din_pc] [get_bd_ports select_din_pc_0]
connect_bd_net [get_bd_pins spaciroc3_sc_0/resetb_pc] [get_bd_ports resetb_pc_0]
connect_bd_net [get_bd_pins spaciroc3_sc_0/select_sc_probe_pc] [get_bd_ports select_sc_probe_pc_0]
connect_bd_net [get_bd_pins spaciroc3_sc_0/sr_rstb_pc] [get_bd_ports sr_rstb_pc_0]
connect_bd_net [get_bd_pins spaciroc3_sc_0/sr_ck_pc] [get_bd_ports sr_ck_pc_0] [get_bd_ports sr_ck_pc_2] [get_bd_ports sr_ck_pc_1]
connect_bd_net [get_bd_pins HV_AERA_IP_0/GTU_HV_p] [get_bd_ports GTU_HV_p_0]
connect_bd_net [get_bd_pins HV_AERA_IP_0/GTU_HV_n] [get_bd_ports GTU_HV_n_0]
connect_bd_net [get_bd_pins HV_AERA_IP_0/CLK_HV_p] [get_bd_ports CLK_HV_p_0]
connect_bd_net [get_bd_pins HV_AERA_IP_0/CLK_HV_n] [get_bd_ports CLK_HV_n_0]
connect_bd_net [get_bd_pins HV_AERA_IP_0/DATA_HV_p] [get_bd_ports DATA_HV_p_0]
connect_bd_net [get_bd_pins HV_AERA_IP_0/DATA_HV_n] [get_bd_ports DATA_HV_n_0]
connect_bd_net [get_bd_pins axi_quad_spi_0/io0_o] [get_bd_ports io0_o_3] [get_bd_ports io0_o_2] [get_bd_ports io0_o_1] [get_bd_ports io0_o_0]
connect_bd_net [get_bd_pins axi_quad_spi_0/sck_o] [get_bd_ports sck_o_3] [get_bd_ports sck_o_2] [get_bd_ports sck_o_1] [get_bd_ports sck_o_0]
connect_bd_net -net artx_done_0_1 [get_bd_ports artx_done_0] [get_bd_pins axi_artix_conf_v1_0_0/artx_done]
connect_bd_net [get_bd_pins xlconstant_0/dout] [get_bd_pins selectio_wiz_0/clk_reset]
connect_bd_net [get_bd_pins bitslip_sm_0/rst_selectio] [get_bd_pins selectio_wiz_0/io_reset]
connect_bd_net -net data_in_from_pins_p_1_1 [get_bd_ports data_in_from_pins_p_1] [get_bd_pins selectio_wiz_1/data_in_from_pins_p]
connect_bd_net -net data_in_from_pins_n_1_1 [get_bd_ports data_in_from_pins_n_1] [get_bd_pins selectio_wiz_1/data_in_from_pins_n]
connect_bd_net -net data_in_from_pins_p_2_1 [get_bd_ports data_in_from_pins_p_2] [get_bd_pins selectio_wiz_2/data_in_from_pins_p]
connect_bd_net -net data_in_from_pins_n_2_1 [get_bd_ports data_in_from_pins_n_2] [get_bd_pins selectio_wiz_2/data_in_from_pins_n]
connect_bd_net -net util_ds_buf_2_BUFG_O [get_bd_pins selectio_wiz_1/clk_div_out] \
  [get_bd_pins bitslip_sm_1/clk] [get_bd_pins data_converter_1/clk_art1]
connect_bd_net -net util_ds_buf_1_BUFG_O [get_bd_pins selectio_wiz_2/clk_div_out] \
  [get_bd_pins bitslip_sm_2/clk] [get_bd_pins data_converter_1/clk_art2]
connect_bd_net [get_bd_pins bitslip_sm_0/dataout_last] [get_bd_pins data_converter_1/tlast_art0]
connect_bd_net [get_bd_pins bitslip_sm_1/dataout] [get_bd_pins data_converter_1/tdata_art1]
connect_bd_net [get_bd_pins bitslip_sm_0/dataout] [get_bd_pins data_converter_1/tdata_art0]
connect_bd_net [get_bd_pins bitslip_sm_2/dataout] [get_bd_pins data_converter_1/tdata_art2]
connect_bd_net [get_bd_pins bitslip_sm_1/bitlslip_vector] [get_bd_pins selectio_wiz_1/bitslip]
connect_bd_net [get_bd_pins bitslip_sm_2/bitlslip_vector] [get_bd_pins selectio_wiz_2/bitslip]
connect_bd_net [get_bd_pins bitslip_sm_2/dataout_last] [get_bd_pins data_converter_1/tlast_art2]
connect_bd_net [get_bd_pins bitslip_sm_1/dataout_last] [get_bd_pins data_converter_1/tlast_art1]
connect_bd_net [get_bd_pins bitslip_sm_2/dataout_valid] [get_bd_pins data_converter_1/tvalid_art2]
connect_bd_net [get_bd_pins bitslip_sm_1/dataout_valid] [get_bd_pins data_converter_1/tvalid_art1]
connect_bd_net [get_bd_pins bitslip_sm_1/rst_selectio] [get_bd_pins selectio_wiz_1/io_reset]
connect_bd_net [get_bd_pins bitslip_sm_2/rst_selectio] [get_bd_pins selectio_wiz_2/io_reset]
connect_bd_net [get_bd_pins selectio_wiz_2/data_in_to_device] [get_bd_pins bitslip_sm_2/data_in]
connect_bd_net [get_bd_pins selectio_wiz_1/data_in_to_device] [get_bd_pins bitslip_sm_1/data_in]
connect_bd_net [get_bd_pins axi_dma_sc36/s2mm_introut] [get_bd_pins xlconcat_1/In0]
connect_bd_net [get_bd_pins processing_system7_0/FCLK_CLK0] [get_bd_pins clk_wiz_0/clk_in1]
connect_bd_net [get_bd_pins clk_wiz_0/clk_out1] \
  [get_bd_pins proc_sys_reset_2/slowest_sync_clk] [get_bd_pins axi_fifo_mm_s_0/s_axi_aclk] \
  [get_bd_pins axis_dwidth_converter_2/aclk] [get_bd_pins spaciroc3_sc_0/s00_axis_aclk] \
  [get_bd_pins spaciroc3_sc_0/s00_axi_aclk] [get_bd_pins axi_interconnect_1/M04_ACLK] \
  [get_bd_pins axi_interconnect_1/M01_ACLK]
connect_bd_net [get_bd_pins clk_wiz_0/locked] [get_bd_pins proc_sys_reset_2/ext_reset_in] [get_bd_pins proc_sys_reset_2/aux_reset_in]
connect_bd_net [get_bd_pins proc_sys_reset_2/peripheral_aresetn] \
  [get_bd_pins axi_fifo_mm_s_0/s_axi_aresetn] [get_bd_pins axis_dwidth_converter_2/aresetn] \
  [get_bd_pins spaciroc3_sc_0/s00_axis_aresetn] [get_bd_pins spaciroc3_sc_0/s00_axi_aresetn] \
  [get_bd_pins axi_interconnect_1/M04_ARESETN] [get_bd_pins axi_interconnect_1/M01_ARESETN]
connect_bd_net [get_bd_pins axis_data_fifo_2/axis_data_count] [get_bd_pins axi_data_provider_z3_0/aux_in]
connect_bd_net [get_bd_pins axi_data_provider_z3_0/reset_data_conv] [get_bd_pins data_converter_1/prog_reset_p]
connect_bd_net [get_bd_pins axi_gpio_0/gpio_io_o] [get_bd_pins xlslice_0/Din] [get_bd_pins xlslice_1/Din]
connect_bd_net [get_bd_pins xlslice_0/Dout] [get_bd_ports artx_programb]
connect_bd_net [get_bd_pins xlslice_1/Dout] [get_bd_ports artx_initb]
connect_bd_net [get_bd_pins axi_data_provider_z3_0/zero_pmts] [get_bd_pins data_converter_1/zeros]
connect_bd_net [get_bd_pins util_vector_logic_0/Res] \
  [get_bd_pins scurve_adder36_0/ap_rst_n] [get_bd_pins axis_data_fifo_0/s_axis_aresetn] \
  [get_bd_pins axis_data_fifo_2/s_axis_aresetn]
connect_bd_net [get_bd_pins axi_data_provider_z3_0/reset_scurve_adder] [get_bd_pins util_vector_logic_0/Op2]
connect_bd_net -net sr_out_pc_0_1 [get_bd_ports sr_out_pc_0] [get_bd_pins spaciroc3_sc_0/sr_out_pc]
connect_bd_net [get_bd_pins axi_data_provider_z3_0/FRAME] [get_bd_pins SPB2_1/FRAME]
connect_bd_net [get_bd_pins axi_data_provider_z3_0/DATA] [get_bd_pins SPB2_1/DATA_SPB2]
connect_bd_net [get_bd_pins data_converter_1/clk_counters] [get_bd_pins axi_data_provider_z3_0/aux_in2]
connect_bd_net [get_bd_pins bitslip_sm_0/bitslip_cnt] [get_bd_pins axi_data_provider_z3_0/bitslip_cnt0]
connect_bd_net [get_bd_pins bitslip_sm_1/bitslip_cnt] [get_bd_pins axi_data_provider_z3_0/bitslip_cnt1]
connect_bd_net [get_bd_pins bitslip_sm_2/bitslip_cnt] [get_bd_pins axi_data_provider_z3_0/bitslip_cnt2]
connect_bd_net [get_bd_pins axi_data_provider_z3_0/run_selectio] \
  [get_bd_pins bitslip_sm_0/run] [get_bd_pins bitslip_sm_1/run] [get_bd_pins bitslip_sm_2/run]
connect_bd_net [get_bd_pins axi_data_provider_z3_0/run_data_conv] [get_bd_pins data_converter_1/inp_en]
connect_bd_net [get_bd_pins data_converter_1/tvalid_counters] [get_bd_pins axi_data_provider_z3_0/aux_in3]
connect_bd_net [get_bd_pins axi_data_provider_z3_0/art_gtu] [get_bd_ports art_gtu_2] [get_bd_ports art_gtu_1] [get_bd_ports art_gtu_0]
connect_bd_net [get_bd_pins axis_data_fifo_mps/axis_data_count] [get_bd_pins axi_gpio_0/gpio2_io_i]
connect_bd_net [get_bd_pins axi_data_provider_z3_0/use_alt_frame] [get_bd_pins bitslip_sm_0/use_alt_frame]
connect_bd_net [get_bd_pins axi_artix_conf_v1_0_0/artx_latch] [get_bd_ports artx_latch_3]
connect_bd_net -net SPB_Ext_trig_IN_P_0_1 [get_bd_ports SPB_Ext_trig_IN_P_0] [get_bd_pins axi_clkb_core_0/SPB_Ext_trig_IN_P]
connect_bd_net -net SPB_Ext_trig_IN_N_0_1 [get_bd_ports SPB_Ext_trig_IN_N_0] [get_bd_pins axi_clkb_core_0/SPB_Ext_trig_IN_N]
connect_bd_net -net SPB_CLK_40_p_0_1 [get_bd_ports SPB_CLK_40_p_0] [get_bd_pins axi_clkb_core_0/SPB_CLK_40_p]
connect_bd_net -net SPB_CLK_40_n_0_1 [get_bd_ports SPB_CLK_40_n_0] [get_bd_pins axi_clkb_core_0/SPB_CLK_40_n]
connect_bd_net [get_bd_pins axi_clkb_core_0/SPB_Trig_L1_out_P] [get_bd_ports SPB_Trig_L1_out_P_0]
connect_bd_net [get_bd_pins axi_clkb_core_0/SPB_Trig_L1_out_N] [get_bd_ports SPB_Trig_L1_out_N_0]
connect_bd_net [get_bd_pins axi_clkb_core_0/SPB_Busy_P] [get_bd_ports SPB_Busy_P_0]
connect_bd_net [get_bd_pins axi_clkb_core_0/SPB_Busy_N] [get_bd_ports SPB_Busy_N_0]
connect_bd_net -net spb_gtu_clk_p_1_1 [get_bd_ports spb_gtu_clk_p_0] [get_bd_pins axi_clkb_core_0/spb_gtu_clk_p]
connect_bd_net -net spb_gtu_clk_n_1_1 [get_bd_ports spb_gtu_clk_n_0] [get_bd_pins axi_clkb_core_0/spb_gtu_clk_n]
connect_bd_net -net spb_1pps_p_1_1 [get_bd_ports spb_1pps_p_0] [get_bd_pins axi_clkb_core_0/spb_1pps_p]
connect_bd_net -net spb_1pps_n_1_1 [get_bd_ports spb_1pps_n_0] [get_bd_pins axi_clkb_core_0/spb_1pps_n]
connect_bd_net [get_bd_pins axi_clkb_core_0/SPB_Ext_trig_IN] [get_bd_pins axis_flow_control_d1_0/trig_ext_in]
connect_bd_net [get_bd_pins axis_flow_control_d1_0/busy] [get_bd_pins axi_clkb_core_0/SPB_Busy]
connect_bd_net [get_bd_pins axis_flow_control_d1_0/trig_out] [get_bd_pins axi_clkb_core_0/SPB_Trig_L1_out]
connect_bd_net -net trig_ext_in_lab_0_1 [get_bd_ports trig_ext_in_lab_0] [get_bd_pins axis_flow_control_d1_0/trig_ext_in_lab]

# ---- address map ----
assign_bd_address -offset 0x00000000 -range 1G -target_address_space [get_bd_addr_spaces axi_dma_0/Data_S2MM] [get_bd_addr_segs processing_system7_0/S_AXI_HP0/HP0_DDR_LOWOCM]
assign_bd_address -offset 0x00000000 -range 1G -target_address_space [get_bd_addr_spaces axi_dma_mps/Data_S2MM] [get_bd_addr_segs processing_system7_0/S_AXI_HP0/HP0_DDR_LOWOCM]
assign_bd_address -offset 0x00000000 -range 1G -target_address_space [get_bd_addr_spaces axi_dma_sc36/Data_S2MM] [get_bd_addr_segs processing_system7_0/S_AXI_HP0/HP0_DDR_LOWOCM]
assign_bd_address -offset 0x40400000 -range 64K -target_address_space [get_bd_addr_spaces processing_system7_0/Data] [get_bd_addr_segs axi_dma_0/S_AXI_LITE/Reg]
assign_bd_address -offset 0x40410000 -range 64K -target_address_space [get_bd_addr_spaces processing_system7_0/Data] [get_bd_addr_segs axi_dma_mps/S_AXI_LITE/Reg]
assign_bd_address -offset 0x40420000 -range 64K -target_address_space [get_bd_addr_spaces processing_system7_0/Data] [get_bd_addr_segs axi_dma_sc36/S_AXI_LITE/Reg]
assign_bd_address -offset 0x41200000 -range 64K -target_address_space [get_bd_addr_spaces processing_system7_0/Data] [get_bd_addr_segs axi_gpio_0/S_AXI/Reg]
assign_bd_address -offset 0x41E00000 -range 64K -target_address_space [get_bd_addr_spaces processing_system7_0/Data] [get_bd_addr_segs axi_quad_spi_0/AXI_LITE/Reg]
assign_bd_address -offset 0x43C00000 -range 64K -target_address_space [get_bd_addr_spaces processing_system7_0/Data] [get_bd_addr_segs HV_AERA_IP_0/s00_axi/reg0]
assign_bd_address -offset 0x43C10000 -range 64K -target_address_space [get_bd_addr_spaces processing_system7_0/Data] [get_bd_addr_segs axi_fifo_mm_s_0/S_AXI/Mem0]
assign_bd_address -offset 0x43C20000 -range 64K -target_address_space [get_bd_addr_spaces processing_system7_0/Data] [get_bd_addr_segs hv_hk_v1_0_0/s00_axi/reg0]
assign_bd_address -offset 0x43C30000 -range 64K -target_address_space [get_bd_addr_spaces processing_system7_0/Data] [get_bd_addr_segs spaciroc3_sc_0/s00_axi/reg0]
assign_bd_address -offset 0x43C40000 -range 64K -target_address_space [get_bd_addr_spaces processing_system7_0/Data] [get_bd_addr_segs axi_artix_conf_v1_0_0/s00_axi/reg0]
assign_bd_address -offset 0x43C50000 -range 64K -target_address_space [get_bd_addr_spaces processing_system7_0/Data] [get_bd_addr_segs axis_flow_control_d1_0/S_AXI/reg0]
assign_bd_address -offset 0x43C60000 -range 64K -target_address_space [get_bd_addr_spaces processing_system7_0/Data] [get_bd_addr_segs axi_fifo_mm_s_1/S_AXI/Mem0]
assign_bd_address -offset 0x43C70000 -range 64K -target_address_space [get_bd_addr_spaces processing_system7_0/Data] [get_bd_addr_segs axi_data_provider_z3_0/S_AXI/reg0]
assign_bd_address -offset 0x43C80000 -range 64K -target_address_space [get_bd_addr_spaces processing_system7_0/Data] [get_bd_addr_segs scurve_adder36_0/s_axi_CTRL_BUS/Reg]
assign_bd_address -offset 0x43C90000 -range 64K -target_address_space [get_bd_addr_spaces processing_system7_0/Data] [get_bd_addr_segs axi_clkb_core_0/S_AXI/reg0]

validate_bd_design
save_bd_design
